# Altium schematic sheet Camera_Schematics.SchDoc
size A
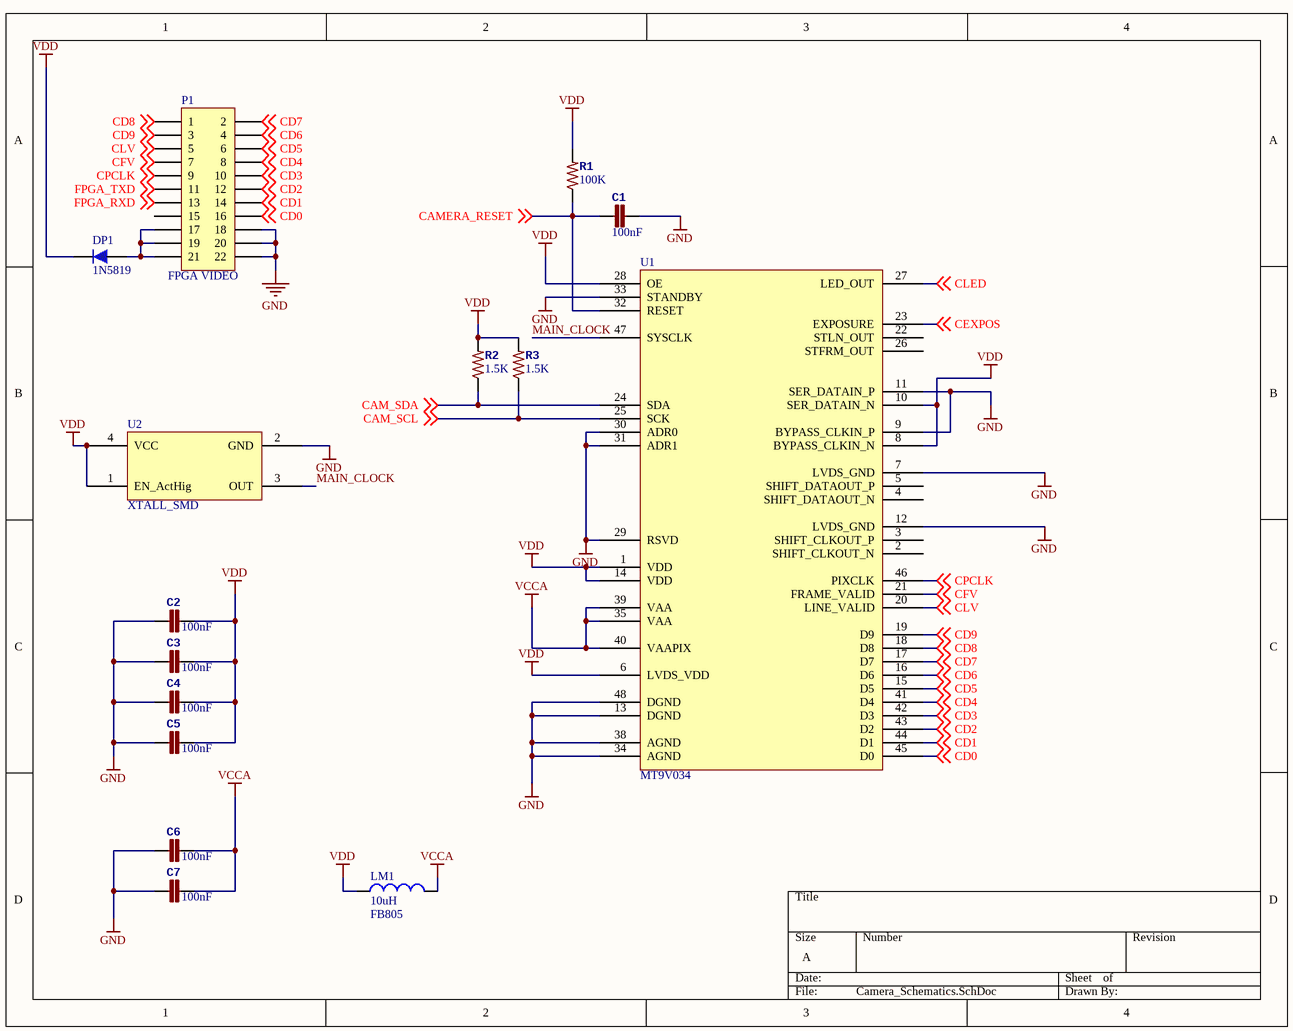
[diagram p0: Camera_Schematics.SchDoc]

## Parts
C1  value 100nF  [_0805]  (hidden comment: Cap)
C2  value 100nF  [_0805]  (hidden comment: Cap)
C3  value 100nF  [_0805]  (hidden comment: Cap)
C4  value 100nF  [_0805]  (hidden comment: Cap)
C5  value 100nF  [_0805]  (hidden comment: Cap)
C6  value 100nF  [_0805]  (hidden comment: Cap)
C7  value 100nF  [_0805]  (hidden comment: Cap)
DP1  1N5819  [430X270D]
LM1  10uH  value FB805  [0805L]
P1  FPGA VIDEO  [HDR2X11]
R1  value 100K  [_0603]  (hidden comment: Resistor)
R2  value 1.5K  [_0603]  (hidden comment: Resistor)
R3  value 1.5K  [_0603]  (hidden comment: Resistor)
U1  MT9V034  [MT9V034]
U2  XTALL_SMD  [XTAL_SMD]

## Nets
GND: C1.2 C2.1 C3.1 C4.1 C5.1 C6.1 C7.1 P1.18 P1.20 P1.22 U1.7(LVDS_GND) U1.9(BYPASS_CLKIN_P) U1.11(SER_DATAIN_P) U1.12(LVDS_GND) U1.13(DGND) U1.29(RSVD) U1.30(ADR0) U1.31(ADR1) U1.33(STANDBY) U1.34(AGND) U1.38(AGND) U1.48(DGND) U2.2(GND)
VCCA: C6.2 C7.2 LM1.2 U1.35(VAA) U1.39(VAA) U1.40(VAAPIX)
VDD: C2.2 C3.2 C4.2 C5.2 DP1.2 LM1.1 R1.2 R2.2 R3.2 U1.1(VDD) U1.6(LVDS_VDD) U1.8(BYPASS_CLKIN_N) U1.10(SER_DATAIN_N) U1.14(VDD) U1.28(OE) U2.1(EN_ActHig) U2.4(VCC)
CAM_SCL: R3.1 U1.25(SCK) ; off-sheet CAM_SCL
CAM_SDA: R2.1 U1.24(SDA) ; off-sheet CAM_SDA
CAMERA_RESET: C1.1 R1.1 U1.32(RESET) ; off-sheet CAMERA_RESET
CD0: P1.16 U1.45(D0) ; off-sheet CD0
CD1: P1.14 U1.44(D1) ; off-sheet CD1
CD2: P1.12 U1.43(D2) ; off-sheet CD2
CD3: P1.10 U1.42(D3) ; off-sheet CD3
CD4: P1.8 U1.41(D4) ; off-sheet CD4
CD5: P1.6 U1.15(D5) ; off-sheet CD5
CD6: P1.4 U1.16(D6) ; off-sheet CD6
CD7: P1.2 U1.17(D7) ; off-sheet CD7
CD8: P1.1 U1.18(D8) ; off-sheet CD8
CD9: P1.3 U1.19(D9) ; off-sheet CD9
CEXPOS: U1.23(EXPOSURE) ; off-sheet CEXPOS
CFV: P1.7 U1.21(FRAME_VALID) ; off-sheet CFV
CLED: U1.27(LED_OUT) ; off-sheet CLED
CLV: P1.5 U1.20(LINE_VALID) ; off-sheet CLV
CPCLK: P1.9 U1.46(PIXCLK) ; off-sheet CPCLK
FPGA_RXD: P1.13 ; off-sheet FPGA_RXD
FPGA_TXD: P1.11 ; off-sheet FPGA_TXD
MAIN_CLOCK: U1.47(SYSCLK) U2.3(OUT)
NetDP1_1: DP1.1 P1.17 P1.19 P1.21

Not connected (* = marked no-connect by the designer): P1 15; U1 2(SHIFT_CLKOUT_N) 3(SHIFT_CLKOUT_P) 4(SHIFT_DATAOUT_N) 5(SHIFT_DATAOUT_P) 22(STLN_OUT) 26(STFRM_OUT)

## Library data of the parts
C1-C7 = Cap_1
DP1 = 1N5819: Schottkey Rectifiers; Designer: Abbas Basereh; Data: 16-12-2016; Link: *; Part. No: *
LM1 = L SMA 0.25W: Inductor; Code_IEC: 1005; Published: 8-Jun-2000; LatestRevisionDate: 29-May-2009; LatestRevisionNote: IPC-7351 Footprint Added.; PackageReference: 0402-A; Publisher: Altium Limited; PackageDescription: Chip Inductor; Code_JEITA: 0402
P1 = Header 11X2: Header, 11-Pin, Dual row; LatestRevisionDate: 17-Jul-2002; LatestRevisionNote: Re-released for DXP Platform.; Publisher: Altium Limited
U2 = XTAL_SMD